# EAGLE schematic Maker Display4 (EAGLE 7.3.0), part 2 of 2
## Sheet 8 of 9: LED matrix 4
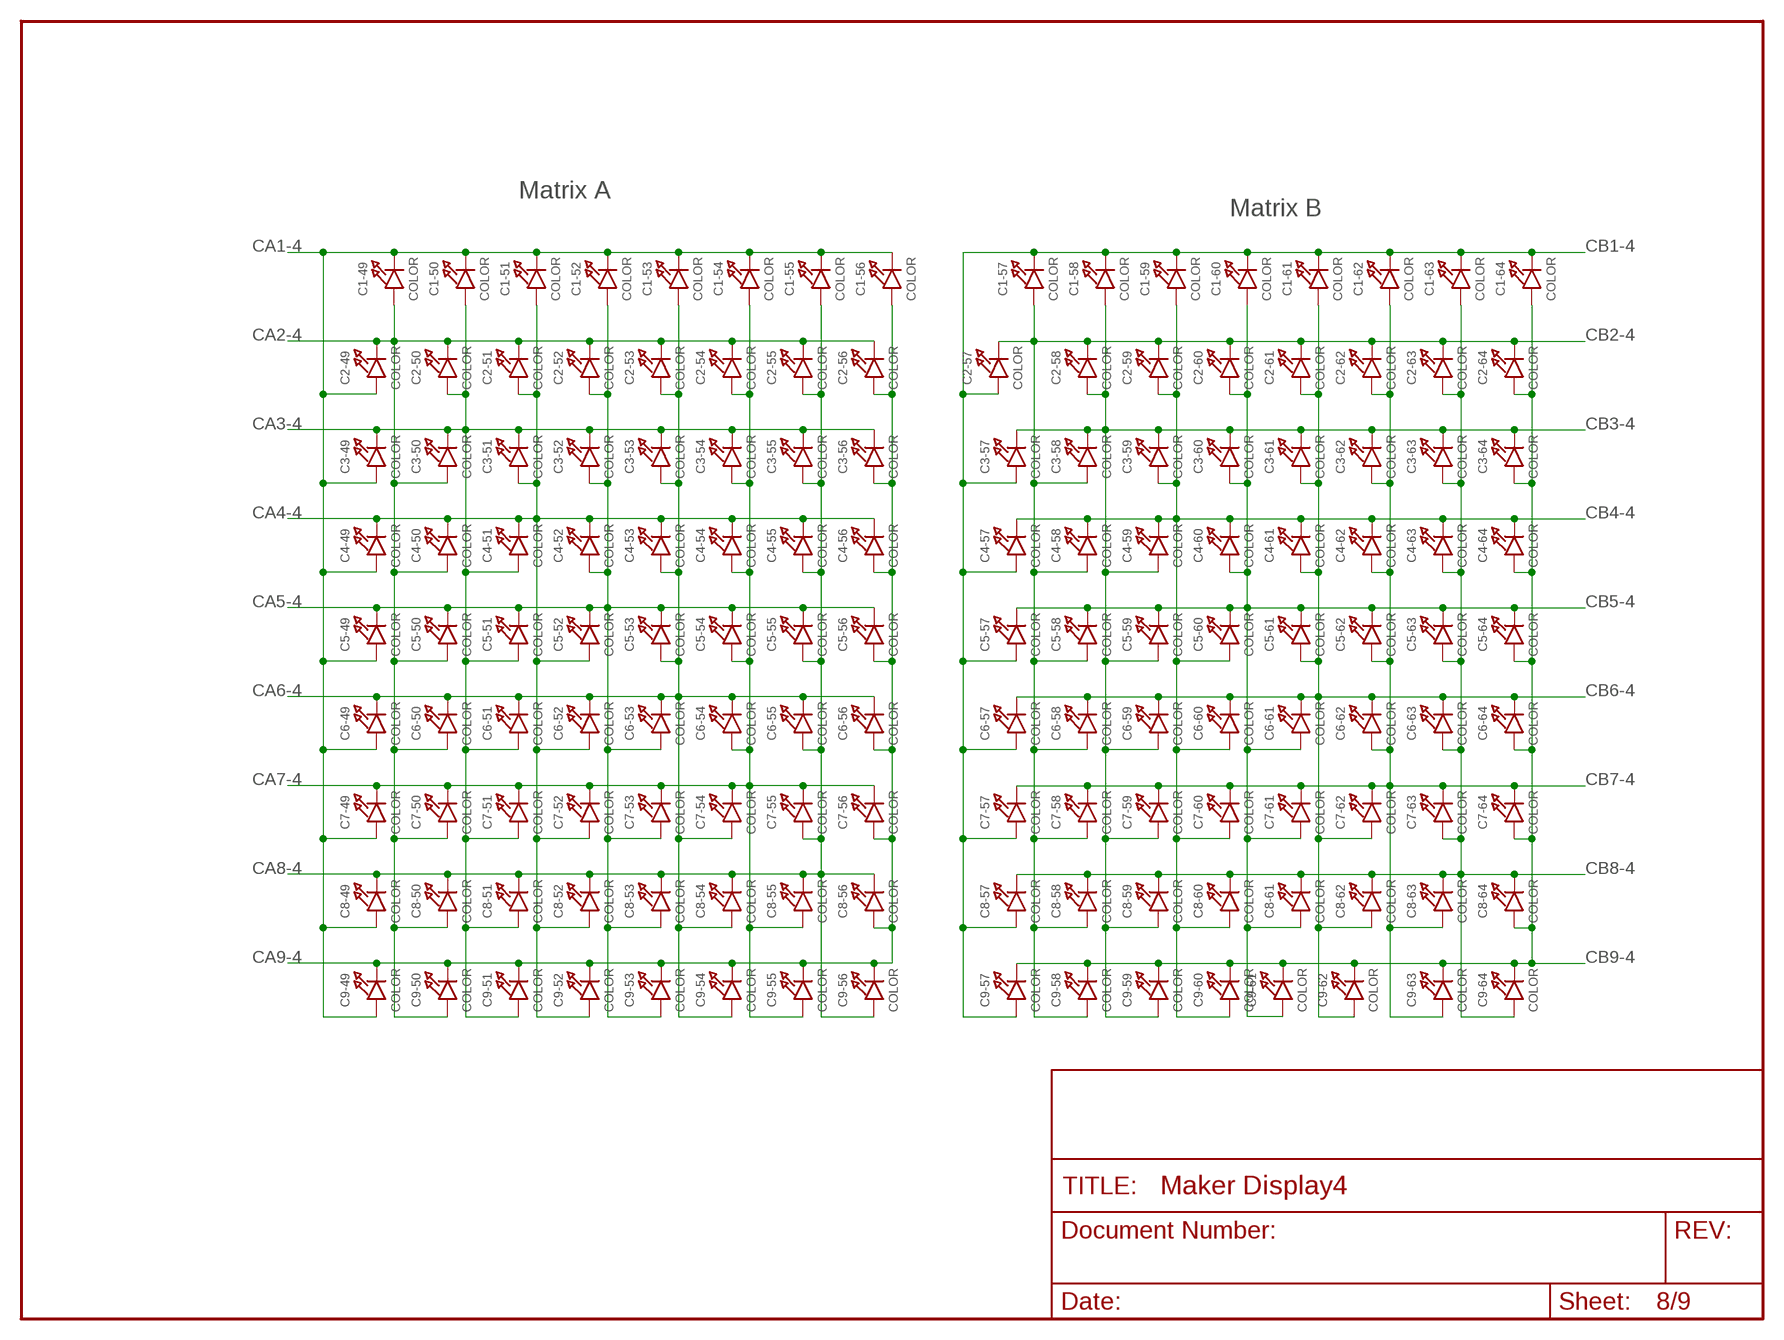
[diagram p7: schematic, sheet 8]

### Parts
C1-49  COLOR  LED0603_NOOUTLINE  [CHIPLED_0603_NOOUTLINE]
C1-50  COLOR  LED0603_NOOUTLINE  [CHIPLED_0603_NOOUTLINE]
C1-51  COLOR  LED0603_NOOUTLINE  [CHIPLED_0603_NOOUTLINE]
C1-52  COLOR  LED0603_NOOUTLINE  [CHIPLED_0603_NOOUTLINE]
C1-53  COLOR  LED0603_NOOUTLINE  [CHIPLED_0603_NOOUTLINE]
C1-54  COLOR  LED0603_NOOUTLINE  [CHIPLED_0603_NOOUTLINE]
C1-55  COLOR  LED0603_NOOUTLINE  [CHIPLED_0603_NOOUTLINE]
C1-56  COLOR  LED0603_NOOUTLINE  [CHIPLED_0603_NOOUTLINE]
C1-57  COLOR  LED0603_NOOUTLINE  [CHIPLED_0603_NOOUTLINE]
C1-58  COLOR  LED0603_NOOUTLINE  [CHIPLED_0603_NOOUTLINE]
C1-59  COLOR  LED0603_NOOUTLINE  [CHIPLED_0603_NOOUTLINE]
C1-60  COLOR  LED0603_NOOUTLINE  [CHIPLED_0603_NOOUTLINE]
C1-61  COLOR  LED0603_NOOUTLINE  [CHIPLED_0603_NOOUTLINE]
C1-62  COLOR  LED0603_NOOUTLINE  [CHIPLED_0603_NOOUTLINE]
C1-63  COLOR  LED0603_NOOUTLINE  [CHIPLED_0603_NOOUTLINE]
C1-64  COLOR  LED0603_NOOUTLINE  [CHIPLED_0603_NOOUTLINE]
C2-49  COLOR  LED0603_NOOUTLINE  [CHIPLED_0603_NOOUTLINE]
C2-50  COLOR  LED0603_NOOUTLINE  [CHIPLED_0603_NOOUTLINE]
C2-51  COLOR  LED0603_NOOUTLINE  [CHIPLED_0603_NOOUTLINE]
C2-52  COLOR  LED0603_NOOUTLINE  [CHIPLED_0603_NOOUTLINE]
C2-53  COLOR  LED0603_NOOUTLINE  [CHIPLED_0603_NOOUTLINE]
C2-54  COLOR  LED0603_NOOUTLINE  [CHIPLED_0603_NOOUTLINE]
C2-55  COLOR  LED0603_NOOUTLINE  [CHIPLED_0603_NOOUTLINE]
C2-56  COLOR  LED0603_NOOUTLINE  [CHIPLED_0603_NOOUTLINE]
C2-57  COLOR  LED0603_NOOUTLINE  [CHIPLED_0603_NOOUTLINE]
C2-58  COLOR  LED0603_NOOUTLINE  [CHIPLED_0603_NOOUTLINE]
C2-59  COLOR  LED0603_NOOUTLINE  [CHIPLED_0603_NOOUTLINE]
C2-60  COLOR  LED0603_NOOUTLINE  [CHIPLED_0603_NOOUTLINE]
C2-61  COLOR  LED0603_NOOUTLINE  [CHIPLED_0603_NOOUTLINE]
C2-62  COLOR  LED0603_NOOUTLINE  [CHIPLED_0603_NOOUTLINE]
C2-63  COLOR  LED0603_NOOUTLINE  [CHIPLED_0603_NOOUTLINE]
C2-64  COLOR  LED0603_NOOUTLINE  [CHIPLED_0603_NOOUTLINE]
C3-49  COLOR  LED0603_NOOUTLINE  [CHIPLED_0603_NOOUTLINE]
C3-50  COLOR  LED0603_NOOUTLINE  [CHIPLED_0603_NOOUTLINE]
C3-51  COLOR  LED0603_NOOUTLINE  [CHIPLED_0603_NOOUTLINE]
C3-52  COLOR  LED0603_NOOUTLINE  [CHIPLED_0603_NOOUTLINE]
C3-53  COLOR  LED0603_NOOUTLINE  [CHIPLED_0603_NOOUTLINE]
C3-54  COLOR  LED0603_NOOUTLINE  [CHIPLED_0603_NOOUTLINE]
C3-55  COLOR  LED0603_NOOUTLINE  [CHIPLED_0603_NOOUTLINE]
C3-56  COLOR  LED0603_NOOUTLINE  [CHIPLED_0603_NOOUTLINE]
C3-57  COLOR  LED0603_NOOUTLINE  [CHIPLED_0603_NOOUTLINE]
C3-58  COLOR  LED0603_NOOUTLINE  [CHIPLED_0603_NOOUTLINE]
C3-59  COLOR  LED0603_NOOUTLINE  [CHIPLED_0603_NOOUTLINE]
C3-60  COLOR  LED0603_NOOUTLINE  [CHIPLED_0603_NOOUTLINE]
C3-61  COLOR  LED0603_NOOUTLINE  [CHIPLED_0603_NOOUTLINE]
C3-62  COLOR  LED0603_NOOUTLINE  [CHIPLED_0603_NOOUTLINE]
C3-63  COLOR  LED0603_NOOUTLINE  [CHIPLED_0603_NOOUTLINE]
C3-64  COLOR  LED0603_NOOUTLINE  [CHIPLED_0603_NOOUTLINE]
C4-49  COLOR  LED0603_NOOUTLINE  [CHIPLED_0603_NOOUTLINE]
C4-50  COLOR  LED0603_NOOUTLINE  [CHIPLED_0603_NOOUTLINE]
C4-51  COLOR  LED0603_NOOUTLINE  [CHIPLED_0603_NOOUTLINE]
C4-52  COLOR  LED0603_NOOUTLINE  [CHIPLED_0603_NOOUTLINE]
C4-53  COLOR  LED0603_NOOUTLINE  [CHIPLED_0603_NOOUTLINE]
C4-54  COLOR  LED0603_NOOUTLINE  [CHIPLED_0603_NOOUTLINE]
C4-55  COLOR  LED0603_NOOUTLINE  [CHIPLED_0603_NOOUTLINE]
C4-56  COLOR  LED0603_NOOUTLINE  [CHIPLED_0603_NOOUTLINE]
C4-57  COLOR  LED0603_NOOUTLINE  [CHIPLED_0603_NOOUTLINE]
C4-58  COLOR  LED0603_NOOUTLINE  [CHIPLED_0603_NOOUTLINE]
C4-59  COLOR  LED0603_NOOUTLINE  [CHIPLED_0603_NOOUTLINE]
C4-60  COLOR  LED0603_NOOUTLINE  [CHIPLED_0603_NOOUTLINE]
C4-61  COLOR  LED0603_NOOUTLINE  [CHIPLED_0603_NOOUTLINE]
C4-62  COLOR  LED0603_NOOUTLINE  [CHIPLED_0603_NOOUTLINE]
C4-63  COLOR  LED0603_NOOUTLINE  [CHIPLED_0603_NOOUTLINE]
C4-64  COLOR  LED0603_NOOUTLINE  [CHIPLED_0603_NOOUTLINE]
C5-49  COLOR  LED0603_NOOUTLINE  [CHIPLED_0603_NOOUTLINE]
C5-50  COLOR  LED0603_NOOUTLINE  [CHIPLED_0603_NOOUTLINE]
C5-51  COLOR  LED0603_NOOUTLINE  [CHIPLED_0603_NOOUTLINE]
C5-52  COLOR  LED0603_NOOUTLINE  [CHIPLED_0603_NOOUTLINE]
C5-53  COLOR  LED0603_NOOUTLINE  [CHIPLED_0603_NOOUTLINE]
C5-54  COLOR  LED0603_NOOUTLINE  [CHIPLED_0603_NOOUTLINE]
C5-55  COLOR  LED0603_NOOUTLINE  [CHIPLED_0603_NOOUTLINE]
C5-56  COLOR  LED0603_NOOUTLINE  [CHIPLED_0603_NOOUTLINE]
C5-57  COLOR  LED0603_NOOUTLINE  [CHIPLED_0603_NOOUTLINE]
C5-58  COLOR  LED0603_NOOUTLINE  [CHIPLED_0603_NOOUTLINE]
C5-59  COLOR  LED0603_NOOUTLINE  [CHIPLED_0603_NOOUTLINE]
C5-60  COLOR  LED0603_NOOUTLINE  [CHIPLED_0603_NOOUTLINE]
C5-61  COLOR  LED0603_NOOUTLINE  [CHIPLED_0603_NOOUTLINE]
C5-62  COLOR  LED0603_NOOUTLINE  [CHIPLED_0603_NOOUTLINE]
C5-63  COLOR  LED0603_NOOUTLINE  [CHIPLED_0603_NOOUTLINE]
C5-64  COLOR  LED0603_NOOUTLINE  [CHIPLED_0603_NOOUTLINE]
C6-49  COLOR  LED0603_NOOUTLINE  [CHIPLED_0603_NOOUTLINE]
C6-50  COLOR  LED0603_NOOUTLINE  [CHIPLED_0603_NOOUTLINE]
C6-51  COLOR  LED0603_NOOUTLINE  [CHIPLED_0603_NOOUTLINE]
C6-52  COLOR  LED0603_NOOUTLINE  [CHIPLED_0603_NOOUTLINE]
C6-53  COLOR  LED0603_NOOUTLINE  [CHIPLED_0603_NOOUTLINE]
C6-54  COLOR  LED0603_NOOUTLINE  [CHIPLED_0603_NOOUTLINE]
C6-55  COLOR  LED0603_NOOUTLINE  [CHIPLED_0603_NOOUTLINE]
C6-56  COLOR  LED0603_NOOUTLINE  [CHIPLED_0603_NOOUTLINE]
C6-57  COLOR  LED0603_NOOUTLINE  [CHIPLED_0603_NOOUTLINE]
C6-58  COLOR  LED0603_NOOUTLINE  [CHIPLED_0603_NOOUTLINE]
C6-59  COLOR  LED0603_NOOUTLINE  [CHIPLED_0603_NOOUTLINE]
C6-60  COLOR  LED0603_NOOUTLINE  [CHIPLED_0603_NOOUTLINE]
C6-61  COLOR  LED0603_NOOUTLINE  [CHIPLED_0603_NOOUTLINE]
C6-62  COLOR  LED0603_NOOUTLINE  [CHIPLED_0603_NOOUTLINE]
C6-63  COLOR  LED0603_NOOUTLINE  [CHIPLED_0603_NOOUTLINE]
C6-64  COLOR  LED0603_NOOUTLINE  [CHIPLED_0603_NOOUTLINE]
C7-49  COLOR  LED0603_NOOUTLINE  [CHIPLED_0603_NOOUTLINE]
C7-50  COLOR  LED0603_NOOUTLINE  [CHIPLED_0603_NOOUTLINE]
C7-51  COLOR  LED0603_NOOUTLINE  [CHIPLED_0603_NOOUTLINE]
C7-52  COLOR  LED0603_NOOUTLINE  [CHIPLED_0603_NOOUTLINE]
C7-53  COLOR  LED0603_NOOUTLINE  [CHIPLED_0603_NOOUTLINE]
C7-54  COLOR  LED0603_NOOUTLINE  [CHIPLED_0603_NOOUTLINE]
C7-55  COLOR  LED0603_NOOUTLINE  [CHIPLED_0603_NOOUTLINE]
C7-56  COLOR  LED0603_NOOUTLINE  [CHIPLED_0603_NOOUTLINE]
C7-57  COLOR  LED0603_NOOUTLINE  [CHIPLED_0603_NOOUTLINE]
C7-58  COLOR  LED0603_NOOUTLINE  [CHIPLED_0603_NOOUTLINE]
C7-59  COLOR  LED0603_NOOUTLINE  [CHIPLED_0603_NOOUTLINE]
C7-60  COLOR  LED0603_NOOUTLINE  [CHIPLED_0603_NOOUTLINE]
C7-61  COLOR  LED0603_NOOUTLINE  [CHIPLED_0603_NOOUTLINE]
C7-62  COLOR  LED0603_NOOUTLINE  [CHIPLED_0603_NOOUTLINE]
C7-63  COLOR  LED0603_NOOUTLINE  [CHIPLED_0603_NOOUTLINE]
C7-64  COLOR  LED0603_NOOUTLINE  [CHIPLED_0603_NOOUTLINE]
C8-49  COLOR  LED0603_NOOUTLINE  [CHIPLED_0603_NOOUTLINE]
C8-50  COLOR  LED0603_NOOUTLINE  [CHIPLED_0603_NOOUTLINE]
C8-51  COLOR  LED0603_NOOUTLINE  [CHIPLED_0603_NOOUTLINE]
C8-52  COLOR  LED0603_NOOUTLINE  [CHIPLED_0603_NOOUTLINE]
C8-53  COLOR  LED0603_NOOUTLINE  [CHIPLED_0603_NOOUTLINE]
C8-54  COLOR  LED0603_NOOUTLINE  [CHIPLED_0603_NOOUTLINE]
C8-55  COLOR  LED0603_NOOUTLINE  [CHIPLED_0603_NOOUTLINE]
C8-56  COLOR  LED0603_NOOUTLINE  [CHIPLED_0603_NOOUTLINE]
C8-57  COLOR  LED0603_NOOUTLINE  [CHIPLED_0603_NOOUTLINE]
C8-58  COLOR  LED0603_NOOUTLINE  [CHIPLED_0603_NOOUTLINE]
C8-59  COLOR  LED0603_NOOUTLINE  [CHIPLED_0603_NOOUTLINE]
C8-60  COLOR  LED0603_NOOUTLINE  [CHIPLED_0603_NOOUTLINE]
C8-61  COLOR  LED0603_NOOUTLINE  [CHIPLED_0603_NOOUTLINE]
C8-62  COLOR  LED0603_NOOUTLINE  [CHIPLED_0603_NOOUTLINE]
C8-63  COLOR  LED0603_NOOUTLINE  [CHIPLED_0603_NOOUTLINE]
C8-64  COLOR  LED0603_NOOUTLINE  [CHIPLED_0603_NOOUTLINE]
C9-49  COLOR  LED0603_NOOUTLINE  [CHIPLED_0603_NOOUTLINE]
C9-50  COLOR  LED0603_NOOUTLINE  [CHIPLED_0603_NOOUTLINE]
C9-51  COLOR  LED0603_NOOUTLINE  [CHIPLED_0603_NOOUTLINE]
C9-52  COLOR  LED0603_NOOUTLINE  [CHIPLED_0603_NOOUTLINE]
C9-53  COLOR  LED0603_NOOUTLINE  [CHIPLED_0603_NOOUTLINE]
C9-54  COLOR  LED0603_NOOUTLINE  [CHIPLED_0603_NOOUTLINE]
C9-55  COLOR  LED0603_NOOUTLINE  [CHIPLED_0603_NOOUTLINE]
C9-56  COLOR  LED0603_NOOUTLINE  [CHIPLED_0603_NOOUTLINE]
C9-57  COLOR  LED0603_NOOUTLINE  [CHIPLED_0603_NOOUTLINE]
C9-58  COLOR  LED0603_NOOUTLINE  [CHIPLED_0603_NOOUTLINE]
C9-59  COLOR  LED0603_NOOUTLINE  [CHIPLED_0603_NOOUTLINE]
C9-60  COLOR  LED0603_NOOUTLINE  [CHIPLED_0603_NOOUTLINE]
C9-61  COLOR  LED0603_NOOUTLINE  [CHIPLED_0603_NOOUTLINE]
C9-62  COLOR  LED0603_NOOUTLINE  [CHIPLED_0603_NOOUTLINE]
C9-63  COLOR  LED0603_NOOUTLINE  [CHIPLED_0603_NOOUTLINE]
C9-64  COLOR  LED0603_NOOUTLINE  [CHIPLED_0603_NOOUTLINE]

### Nets
CA1-4: C1-49.C C1-50.C C1-51.C C1-52.C C1-53.C C1-54.C C1-55.C C1-56.C C2-49.A C3-49.A C4-49.A C5-49.A C6-49.A C7-49.A C8-49.A C9-49.A ; also sheet 7
CA2-4: C1-49.A C2-49.C C2-50.C C2-51.C C2-52.C C2-53.C C2-54.C C2-55.C C2-56.C C3-50.A C4-50.A C5-50.A C6-50.A C7-50.A C8-50.A C9-50.A ; also sheet 7
CA3-4: C1-50.A C2-50.A C3-49.C C3-50.C C3-51.C C3-52.C C3-53.C C3-54.C C3-55.C C3-56.C C4-51.A C5-51.A C6-51.A C7-51.A C8-51.A C9-51.A ; also sheet 7
CA4-4: C1-51.A C2-51.A C3-51.A C4-49.C C4-50.C C4-51.C C4-52.C C4-53.C C4-54.C C4-55.C C4-56.C C5-52.A C6-52.A C7-52.A C8-52.A C9-52.A ; also sheet 7
CA5-4: C1-52.A C2-52.A C3-52.A C4-52.A C5-49.C C5-50.C C5-51.C C5-52.C C5-53.C C5-54.C C5-55.C C5-56.C C6-53.A C7-53.A C8-53.A C9-53.A ; also sheet 7
CA6-4: C1-53.A C2-53.A C3-53.A C4-53.A C5-53.A C6-49.C C6-50.C C6-51.C C6-52.C C6-53.C C6-54.C C6-55.C C6-56.C C7-54.A C8-54.A C9-54.A ; also sheet 7
CA7-4: C1-54.A C2-54.A C3-54.A C4-54.A C5-54.A C6-54.A C7-49.C C7-50.C C7-51.C C7-52.C C7-53.C C7-54.C C7-55.C C7-56.C C8-55.A C9-55.A ; also sheet 7
CA8-4: C1-55.A C2-55.A C3-55.A C4-55.A C5-55.A C6-55.A C7-55.A C8-49.C C8-50.C C8-51.C C8-52.C C8-53.C C8-54.C C8-55.C C8-56.C C9-56.A ; also sheet 7
CA9-4: C1-56.A C2-56.A C3-56.A C4-56.A C5-56.A C6-56.A C7-56.A C8-56.A C9-49.C C9-50.C C9-51.C C9-52.C C9-53.C C9-54.C C9-55.C C9-56.C ; also sheet 7
CB1-4: C1-57.C C1-58.C C1-59.C C1-60.C C1-61.C C1-62.C C1-63.C C1-64.C C2-57.A C3-57.A C4-57.A C5-57.A C6-57.A C7-57.A C8-57.A C9-57.A ; also sheet 7
CB2-4: C1-57.A C2-57.C C2-58.C C2-59.C C2-60.C C2-61.C C2-62.C C2-63.C C2-64.C C3-58.A C4-58.A C5-58.A C6-58.A C7-58.A C8-58.A C9-58.A ; also sheet 7
CB3-4: C1-58.A C2-58.A C3-57.C C3-58.C C3-59.C C3-60.C C3-61.C C3-62.C C3-63.C C3-64.C C4-59.A C5-59.A C6-59.A C7-59.A C8-59.A C9-59.A ; also sheet 7
CB4-4: C1-59.A C2-59.A C3-59.A C4-57.C C4-58.C C4-59.C C4-60.C C4-61.C C4-62.C C4-63.C C4-64.C C5-60.A C6-60.A C7-60.A C8-60.A C9-60.A ; also sheet 7
CB5-4: C1-60.A C2-60.A C3-60.A C4-60.A C5-57.C C5-58.C C5-59.C C5-60.C C5-61.C C5-62.C C5-63.C C5-64.C C6-61.A C7-61.A C8-61.A C9-61.A ; also sheet 7
CB6-4: C1-61.A C2-61.A C3-61.A C4-61.A C5-61.A C6-57.C C6-58.C C6-59.C C6-60.C C6-61.C C6-62.C C6-63.C C6-64.C C7-62.A C8-62.A C9-62.A ; also sheet 7
CB7-4: C1-62.A C2-62.A C3-62.A C4-62.A C5-62.A C6-62.A C7-57.C C7-58.C C7-59.C C7-60.C C7-61.C C7-62.C C7-63.C C7-64.C C8-63.A C9-63.A ; also sheet 7
CB8-4: C1-63.A C2-63.A C3-63.A C4-63.A C5-63.A C6-63.A C7-63.A C8-57.C C8-58.C C8-59.C C8-60.C C8-61.C C8-62.C C8-63.C C8-64.C C9-64.A ; also sheet 7
CB9-4: C1-64.A C2-64.A C3-64.A C4-64.A C5-64.A C6-64.A C7-64.A C8-64.A C9-57.C C9-58.C C9-59.C C9-60.C C9-61.C C9-62.C C9-63.C C9-64.C ; also sheet 7

### Notes on the sheet
- Matrix A
- Matrix B

## Sheet 9 of 9: Microcontroller
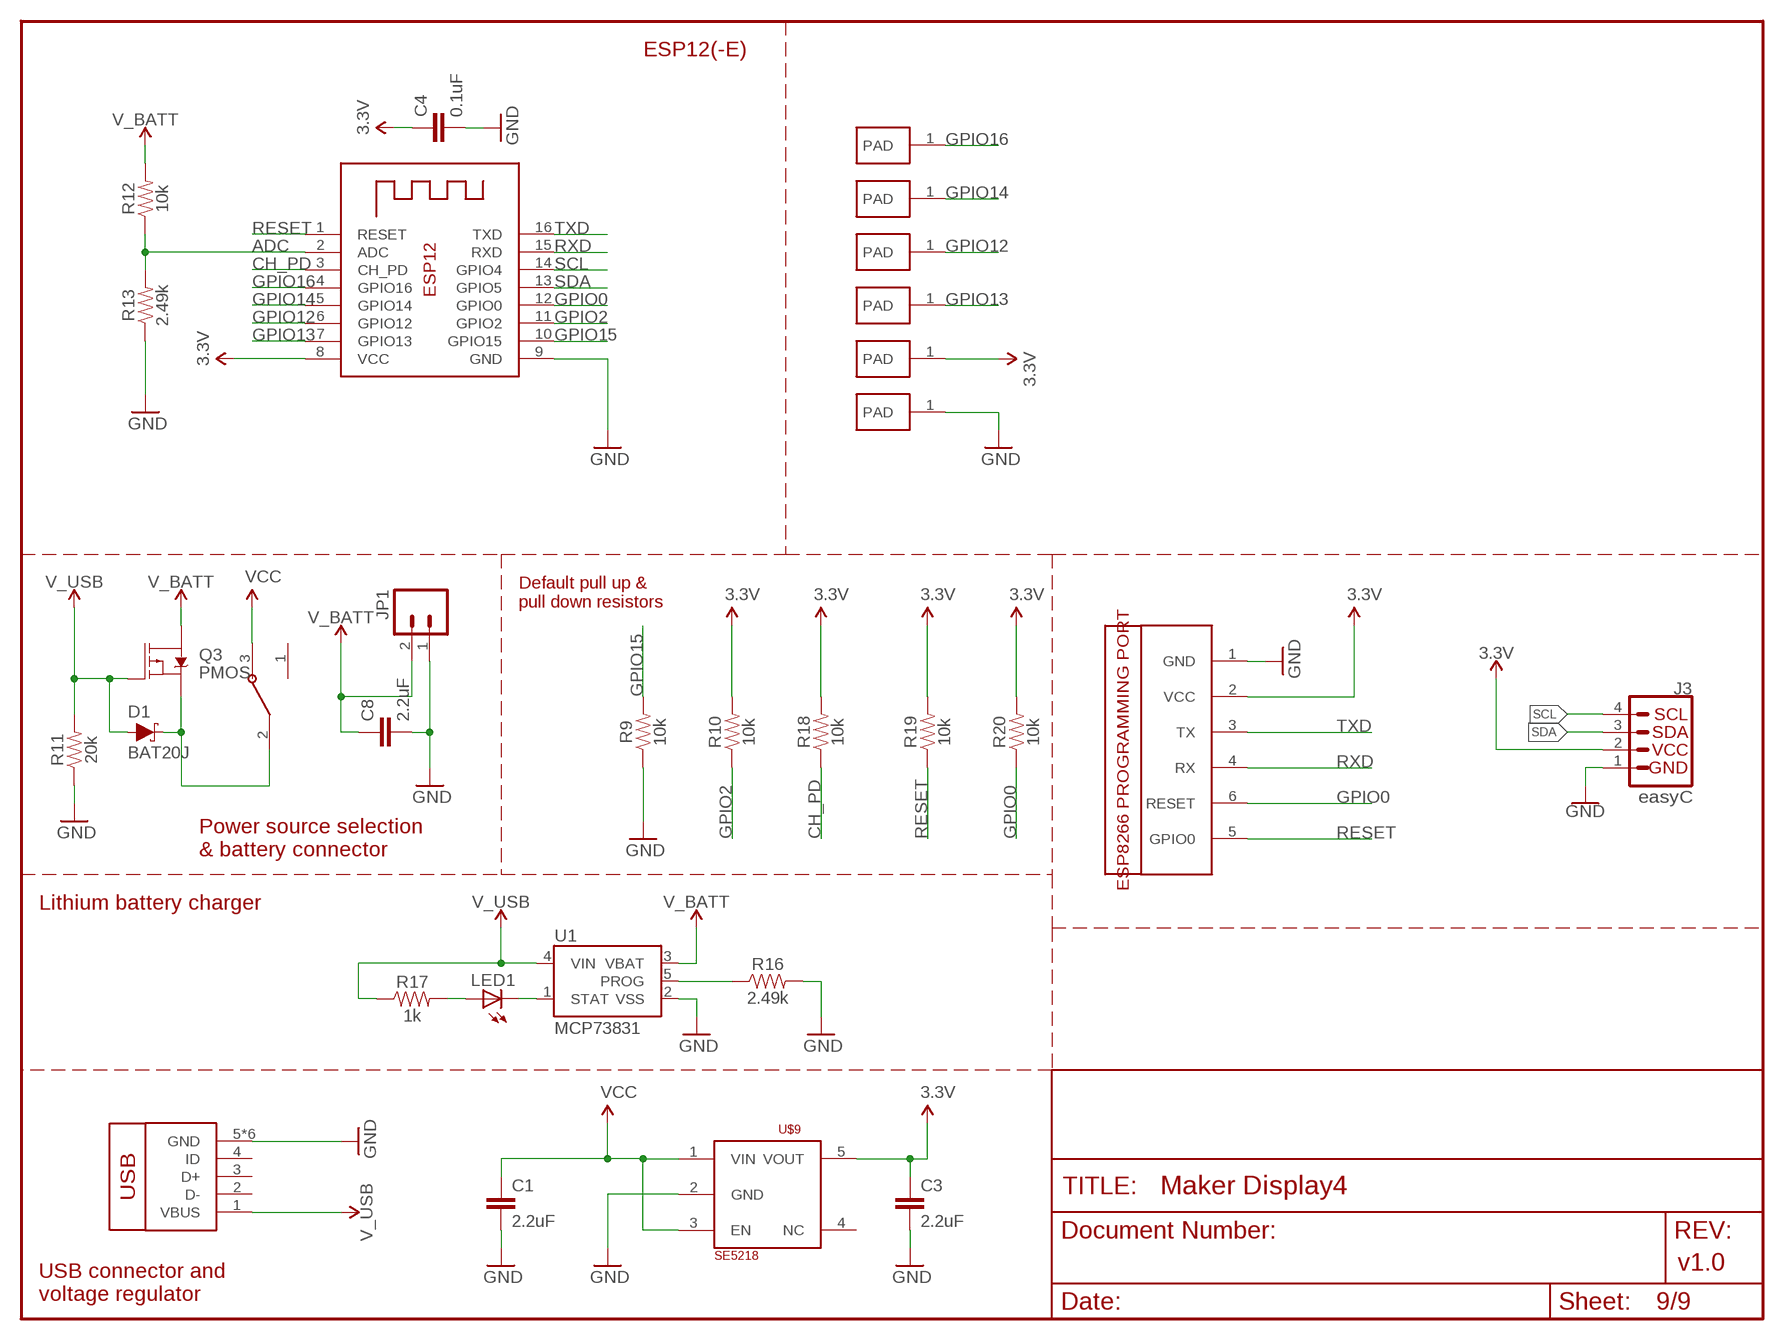
[diagram p8: schematic, sheet 9]

### Parts
C1  2.2uF  2.2UF-0603-10V-20%  [0603]
C3  2.2uF  2.2UF-0603-10V-20%  [0603]
C4  0.1uF  0.1UF-0603-25V-(+80/-20%)  [0603]
C8  2.2uF  2.2UF-0603-10V-20%  [0603]
D1  BAT20J  DIODE-SCHOTTKY-BAT20J  [SOD-323]
J3  QWIIC_CONNECTORJS-1MM  [1X04_1MM_RA]
JP1  M02-JST-2MM-SMT  [JST-2-SMD]
LED1  LEDCHIPLED_0805  [CHIPLED_0805]
Q3  PMOS  MOSFET_PCH-DMG2307L  [SOT23-3]
R9  10k  10KOHM-0603-1/10W-1%  [0603]
R10  10k  10KOHM-0603-1/10W-1%  [0603]
R11  20k  20KOHM-0603-1/10W-1%  [0603]
R12  10k  10KOHM-0603-1/10W-1%  [0603]
R13  2.49k  2.49KOHM-0603-1/10W-1%  [0603]
R16  2.49k  2.49KOHM-0603-1/10W-1%  [0603]
R17  1k  1KOHM-0603-1/10W-1%  [0603]
R18  10k  10KOHM-0603-1/10W-1%  [0603]
R19  10k  10KOHM-0603-1/10W-1%  [0603]
R20  10k  10KOHM-0603-1/10W-1%  [0603]
S1  SWITCH_SK-12D02-VG5  [SK-12D02-VG5]
U1  MCP73831  [SOT23-5]
U$3  ESP-PROGRAMMINGPORT  [ESP-PROGRAMMING-PORT]
U$6  PAD-1  [PAD-1]
U$9  SE5218  [SOT23-5]
U$15  USB-MICRO  [U-F-M5DD-Y-L]
U$16  PAD-1  [PAD-1]
U$18  PAD-1  [PAD-1]
U$19  PAD-1  [PAD-1]
U$20  PAD-1  [PAD-1]
U$21  PAD-1  [PAD-1]
X1  ESP8266-12  ESP-12  [ESP-12]

### Nets
3.3V: C3.1 C4.1 J3.2 R10.2 R18.2 R19.2 R20.2 U$3.2(VCC) U$9.5(VOUT) U$20.1(PAD) X1.8(VCC)
ADC: R12.1 R13.2 X1.2(ADC)
CH_PD: R18.1 X1.3(CH_PD)
GND: C1.2 C3.2 C4.2 C8.2 J3.1 JP1.1 R9.1 R11.1 R13.1 R16.2 U1.2(VSS) U$3.1(GND) U$9.2(GND) U$15.5(GND) U$15.PAD(GND) U$15.SHIELD1(GND) U$15.SHIELD2(GND) U$15.SHIELD3(GND) U$15.SHIELD4(GND) U$21.1(PAD) X1.9(GND) ; also sheet 1,3,5,7
GPIO0: R20.1 U$3.6(RESET) X1.12(GPIO0)
GPIO2: R10.1 X1.11(GPIO2)
GPIO12: U$18.1(PAD) X1.6(GPIO12)
GPIO13: U$19.1(PAD) X1.7(GPIO13)
GPIO14: U$16.1(PAD) X1.5(GPIO14)
GPIO15: R9.2 X1.10(GPIO15)
GPIO16: U$6.1(PAD) X1.4(GPIO16)
N$3: D1.C Q3.2(S) S1.2
N$10: R16.1 U1.5(PROG)
N$14: LED1.C U1.1(STAT)
N$15: LED1.A R17.2
RESET: R19.1 U$3.5(GPIO0) X1.1(RESET)
RXD: U$3.4(RX) X1.15(RXD)
SCL: J3.4 X1.14(GPIO4) ; also sheet 1,3,5,7
SDA: J3.3 X1.13(GPIO5) ; also sheet 1,3,5,7
TXD: U$3.3(TX) X1.16(TXD)
V_BATT: C8.1 JP1.2 Q3.3(D) R12.2 U1.3(VBAT)
V_USB: D1.A Q3.1(G) R11.2 R17.1 U1.4(VIN) U$15.1(VBUS)
VCC: C1.1 S1.3 U$9.1(VIN) U$9.3(EN) ; also sheet 1,3,5,7
Unconnected: S1.1 U$9.4(NC) U$15.2(D-) U$15.3(D+) U$15.4(ID)

### Notes on the sheet
- ESP12(-E)
- Default pull up &
  pull down resistors
- easyC
- Power source selection
  & battery connector
- Lithium battery charger
- v1.0
- USB connector and 
  voltage regulator

## Library data of the parts
C1 C3 C8 = SparkFun-Capacitors:2.2UF: 2.2µF ceramic capacitors A capacitor is a passive two-terminal electrical component used to store electrical energy temporarily in an electric field.; PROD_ID: CAP-07888
C1-1-C1-64 C2-1-C2-64 C3-1-C3-64 C4-1-C4-64 C5-1-C5-64 C6-1-C6-64 C7-1-C7-64 C8-1-C8-64 C9-1-C9-64 = microbuilder:LED: LED
C2 C4 C5 C9-C12 C14 C15 = SparkFun-Capacitors:0.1UF: 0.1µF ceramic capacitors A capacitor is a passive two-terminal electrical component used to store electrical energy temporarily in an electric field.; PROD_ID: CAP-00810
C6 C7 C13 C111 = SparkFun-Capacitors:10UF: 10.0µF ceramic capacitors A capacitor is a passive two-terminal electrical component used to store electrical energy temporarily in an electric field.; PROD_ID: CAP-10057
D1 = SparkFun-DiscreteSemi:DIODE-SCHOTTKY: Schottky diode A Schottky diode is a semiconductor diode which has a low forward voltage drop and a very fast switching action.; PROD_ID: DIO-11623; VALUE: 1A/23V/620mV
J3 = SparkFun-Connectors:QWIIC_CONNECTOR: SparkFun I2C Standard Qwiic Connector An SMD 1mm pitch JST connector makes it easy and quick (get it? Qwiic?) to connect I2C devices to each other. The Qwiic system <http://www.sparkfun.com/qwiic> enables fast and solderless connection between popular platforms and various sensors and actuators. We carry 200mm <https://www.sparkfun.com/products/14204>, 100mm <https://www.sparkfun.com/products/14205>, 50mm <https://www.sparkfun.com/products/14206>, and breadboard friendly <https://www.sparkfun.com/products/14207> Qwiic cables. We also offer 10 pcs strips <https://www.sparkfun.com/products/14323> the SMD connectors.; PROD_ID: CONN-13694
JP1 = SparkFun:M02: Header 2 Standard 2-pin 0.1" header. Use with straight break away headers (SKU : PRT-00116), right angle break away headers (PRT-00553), swiss pins (PRT-00743), machine pins (PRT-00117), and female headers (PRT-00115). Molex polarized connector foot print use with SKU : PRT-08233 with associated crimp pins and housings.
JP2-JP4 = SparkFun:FIDUCIAL: Fiducial Alignment Points Various fiducial points for machine vision alignment.
LED1 = adafruit:LED: LED
Q3 = SparkFun-DiscreteSemi:MOSFET_PCH: P-channel MOSFETs Voltage controlled devices that allow control of high current outputs. SparkFun Products: SparkFun ESP32 Thing <https://www.sparkfun.com/products/13907> SparkFun ESP8266 Thing <https://www.sparkfun.com/products/13231>; PROD_ID: TRANS-11308; VALUE: 2.5A/30V/105mΩ
R1-R3 R6-R8 R11 R14 R15 R22 R25 R26 R28 R31 = SparkFun-Resistors:20KOHM: 20kΩ resistor A resistor is a passive two-terminal electrical component that implements electrical resistance as a circuit element. Resistors act to reduce current flow, and, at the same time, act to lower voltage levels within circuits. - Wikipedia; PROD_ID: RES-09383
R4 R5 = SparkFun-Resistors:4.7KOHM: 4.7kΩ resistor A resistor is a passive two-terminal electrical component that implements electrical resistance as a circuit element. Resistors act to reduce current flow, and, at the same time, act to lower voltage levels within circuits. - Wikipedia; PROD_ID: RES-07857
R9 R10 R12 R18-R20 = SparkFun-Resistors:10KOHM: 10kΩ resistor A resistor is a passive two-terminal electrical component that implements electrical resistance as a circuit element. Resistors act to reduce current flow, and, at the same time, act to lower voltage levels within circuits. - Wikipedia; PROD_ID: RES-00824
R13 R16 = SparkFun-Resistors:2.49KOHM: 2.49kΩ resistor A resistor is a passive two-terminal electrical component that implements electrical resistance as a circuit element. Resistors act to reduce current flow, and, at the same time, act to lower voltage levels within circuits. - Wikipedia; PROD_ID: RES-09568
R17 = SparkFun-Resistors:1KOHM: 1kΩ resistor A resistor is a passive two-terminal electrical component that implements electrical resistance as a circuit element. Resistors act to reduce current flow, and, at the same time, act to lower voltage levels within circuits. - Wikipedia; PROD_ID: RES-07856
S1 = ERADIONICA_2:SWITCH_SK-12D02-VG5
U1 = SparkFun:MCP73831: Microchip's MCP73831 Miniature single cell, fully integrated Li-Ion, Li-polymer charge management controller http://ww1.microchip.com/downloads/en/DeviceDoc/21984a.pdf
U2-U5 = ERADIONICA_2:IS31FL3731: The IS31FL3731 is a compact LED driver for 144 single LEDs. The device can be programmed via an I2C compatible interface. The IS31FL3731 offers two blocks each driving 72 LEDs with 1/9 cycle rate. The required lines to drive all 144 LEDs are reduced to 18 by using the cross-plexing feature optimizing space on the PCB.
U$3 = ERADIONICA:ESP-PROGRAMMINGPORT
U$6 U$16 U$18-U$21 = ERADIONICA:PAD-1
U$9 = ERADIONICA:SE5218
U$15 = ERADIONICA:USB-MICRO
X1 = adafruit:ESP-12